# EAGLE design sonyConnector_ (EAGLE 9.6.2)
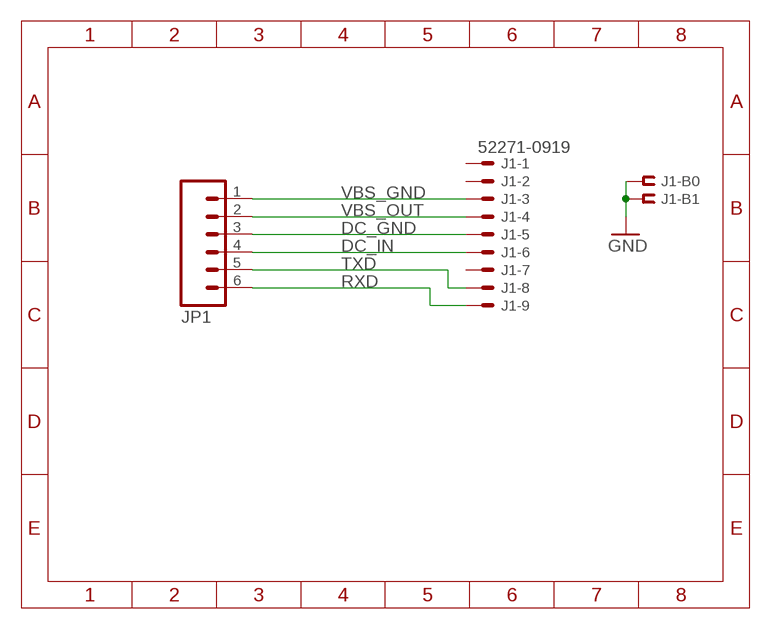
[diagram p0: schematic, sheet 1]

## Parts
J1  52271-0919  [52271-0919]
JP1  M06-XHS-RA  [XHS-6-RA]

## Nets
DC_GND: J1.5 JP1.3
DC_IN: J1.6 JP1.4
GND: J1.BODY J1.BODY@1
RXD: J1.9 JP1.6
TXD: J1.8 JP1.5
VBS_GND: J1.3 JP1.1
VBS_OUT: J1.4 JP1.2
Unconnected: J1.1 J1.2 J1.7

## Library data of the parts
J1 = con-molex:52271-0919: FFC/FPC-to-Board 1.00mm (.039") SMT Top Contact Right Angle, ZIF, Style Receptacle 55271 Source: http://www.molex.com/pdm_docs/sd/522710479_sd.pdf
JP1 = SparkFun-Connectors:M06: Header 6 Standard 6-pin 0.1" header. Use with straight break away headers (SKU : PRT-00116), right angle break away headers (PRT-00553), swiss pins (PRT-00743), machine pins (PRT-00117), and female headers (PRT-00115). Molex polarized connector foot print use with SKU : PRT-08094 with associated crimp pins and housings. NOTES ON THE VARIANTS LOCK and LOCK_LONGPADS... This footprint was designed to help hold the alignment of a through-hole component (i.e. 6-pin header) while soldering it into place. You may notice that each hole has been shifted either up or down by 0.005 of an inch from it's more standard position (which is a perfectly straight line). This slight alteration caused the pins (the squares in the middle) to touch the edges of the holes. Because they are alternating, it causes a "brace" to hold the component in place. 0.005 has proven to be the perfect amount of "off-center" position when using our standard breakaway headers. Although looks a little odd when you look at the bare footprint, once you have a header in there, the alteration is very hard to notice. Also,if you push a header all the way into place, it is covered up entirely on the bottom side. This idea of altering the position of holes to aid alignment will be further integrated into the Sparkfun Library for other footprints. It can help hold any component with 3 or more connection pins.

## Net classes
0 default: width 0.254 mm, drill 0.015 mm, clearance 0.254 mm

## Board
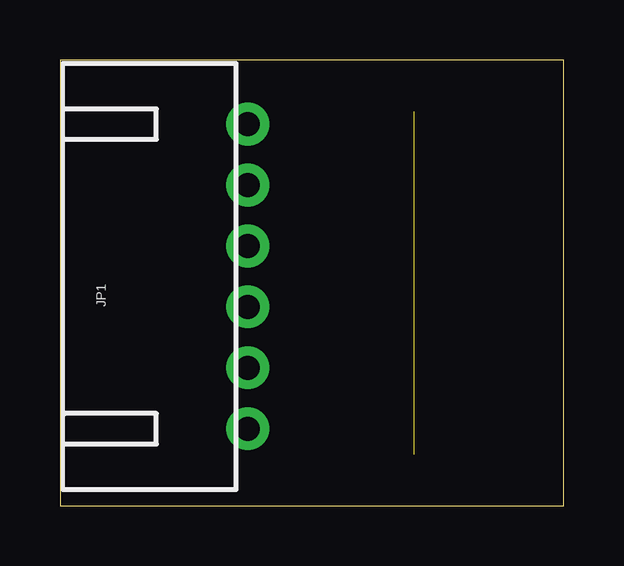
[diagram p1: board, top side]
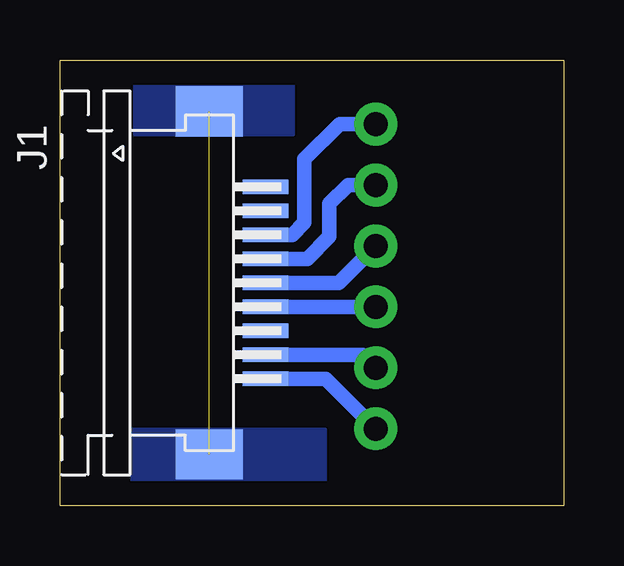
[diagram p2: board, bottom side, seen from below]

Size 20.98 x 18.59 mm. Coordinates in mm from the lower left corner, seen from the top.
Outline: 0,0 20.98,0 20.98,18.59 0,18.59 0,0
Copper layers (1*16): Top 0.035mm / dielectric 1.5mm / Bottom 0.035mm
Design rules "EdesRules": minimum track width 8mil, minimum drill 24mil, track to track 8mil, track to pad 8mil, pad to pad 8mil, via to via 8mil, smd to smd 0mil, copper to edge 40mil, drill to drill 8mil, minimum pad ring 10mil, minimum via ring 8mil, stop-mask expansion 4mil, vias tented up to drill 0mil, thermal gap 10mil

### Footprints (pad centres in the part's own frame; a part is rotated, then mirrored left to right if it is on the bottom)
52271-0919 = smd 0.6 x 1.9: 1 -4,0.95; 2 -3,0.95; 3 -2,0.95; 4 -1,0.95; 5 0,0.95; 6 1,0.95; 7 2,0.95; 8 3,0.95; 9 4,0.95 | smd 2.1 x 2.8: BODY -7.15,-1.4; BODY@1 7.15,-1.4
XHS-6-RA = drill 1 pad 1.778: 1 6.35,0; 2 3.81,0; 3 1.27,0; 4 -1.27,0; 5 -3.81,0; 6 -6.35,0

### Placement (x,y rotation side)
J1  13.36,9.3 270 bottom
JP1  7.82,9.57 90 top

### Tracks (layer width: path | path; a pad name or v marks a point on that pad's centre or on a via)
DC_GND
  Bottom 0.61: JP1.3 9.36,9.3 J1.5
DC_IN
  Bottom 0.61: JP1.4 J1.6 | J1.6
GND  (1 unrouted)
  Bottom 0.61: J1.BODY 15.02,16.71 | 14.87,2.04 J1.BODY@1
  pour Bottom (no thermals): 9.9,3.18 17.99,3.18 17.99,0.05 9.9,0.05
  pour Bottom (no thermals): 11.25,18.58 11.25,15.46 17.87,15.46 17.87,18.58
RXD
  Bottom 0.61: JP1.6 9.9,5.3 J1.9
TXD
  Bottom 0.61: JP1.5 8.36,6.3 J1.8
VBS_GND
  Bottom 0.61: JP1.1 9.33,15.92 10.79,14.45 10.79,11.81 11.31,11.3 J1.3
VBS_OUT
  Bottom 0.61: JP1.2 8.98,13.38 9.75,12.6 9.75,11.22 10.68,10.29 J1.4